# EAGLE design 5vAc Dc (EAGLE 9.6.2)
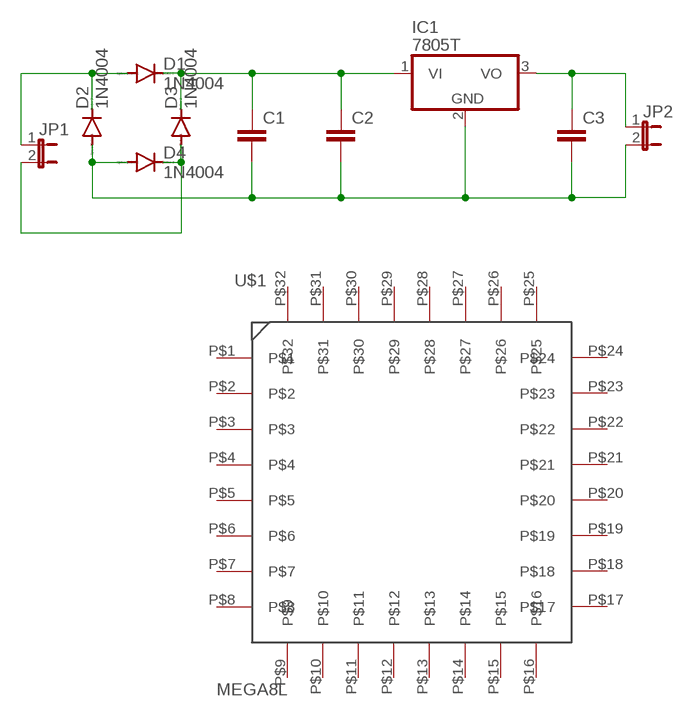
[diagram p0: schematic, sheet 1]

## Parts
C1  C2,5-3  [C2.5-3]
C2  C2,5-3  [C2.5-3]
C3  C2,5-3  [C2.5-3]
D1  1N4004  [DO41-10]
D2  1N4004  [DO41-10]
D3  1N4004  [DO41-10]
D4  1N4004  [DO41-10]
IC1  7805T  [TO220H]
JP1  JP1E  [JP1]
JP2  JP1E  [JP1]
U$1  MEGA8L  [TQFP_MEGA8L]

## Nets
N$1: D1.A D2.C JP1.1
N$2: C1.2 C2.2 C3.2 D2.A D4.A IC1.2(GND) JP2.2
N$3: D3.A D4.C JP1.2
N$4: C1.1 C2.1 D1.C D3.C IC1.1(VI)
N$5: C3.1 IC1.3(VO) JP2.1
Unconnected: U$1.P$1 U$1.P$2 U$1.P$3 U$1.P$4 U$1.P$5 U$1.P$6 U$1.P$7 U$1.P$8 U$1.P$9 U$1.P$10 U$1.P$11 U$1.P$12 U$1.P$13 U$1.P$14 U$1.P$15 U$1.P$16 U$1.P$17 U$1.P$18 U$1.P$19 U$1.P$20 U$1.P$21 U$1.P$22 U$1.P$23 U$1.P$24 U$1.P$25 U$1.P$26 U$1.P$27 U$1.P$28 U$1.P$29 U$1.P$30 U$1.P$31 U$1.P$32

## Library data of the parts
C1-C3 = capacitor-wima:C: CAPACITOR naming: grid - package width
D1-D4 = diode:1N4004: DIODE general purpose rectifier, 1 A
IC1 = linear:78*: Positive VOLTAGE REGULATOR Source: http://cache.national.com/ds/LM/LM78L05.pdf http://www.fairchildsemi.com/ds/LM/LM7805.pdf
JP1 JP2 = jumper:JP1E: JUMPER
U$1 = atmega8:MEGA8L

## Board
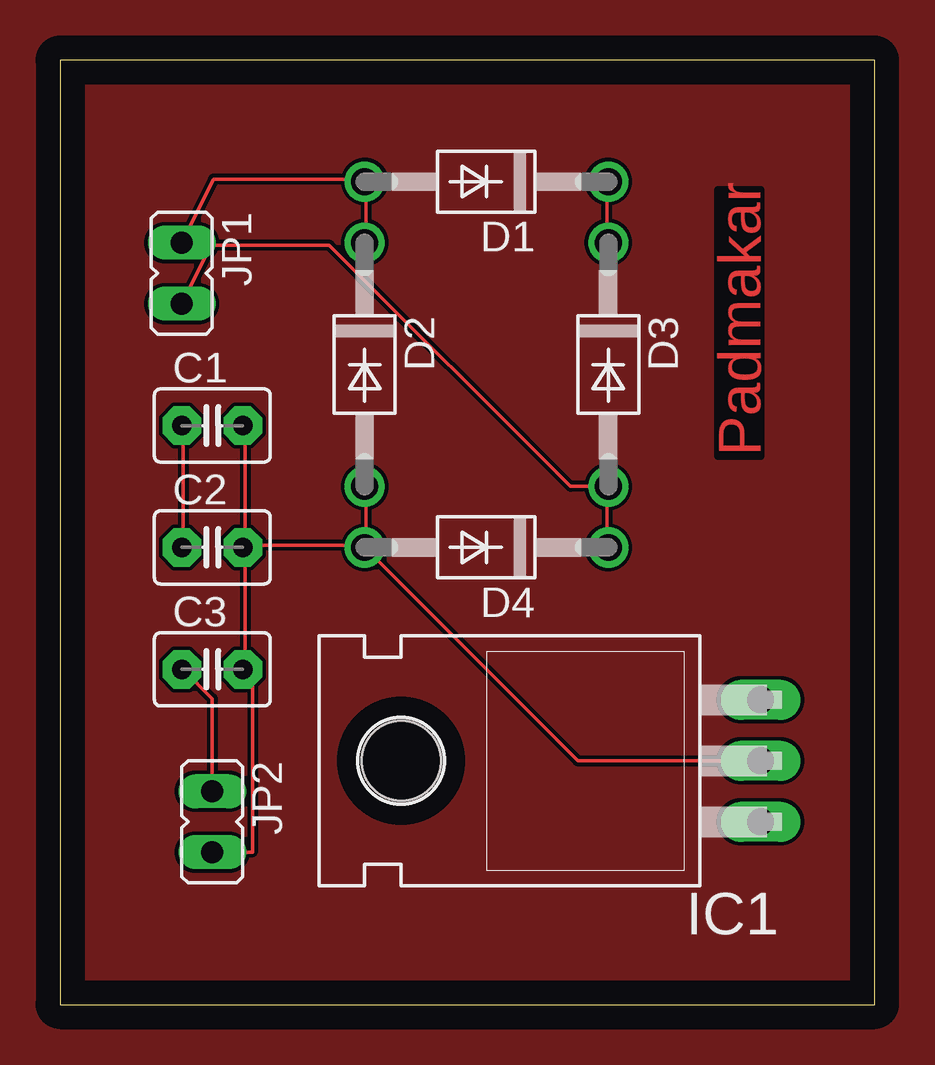
[diagram p1: board, top side]
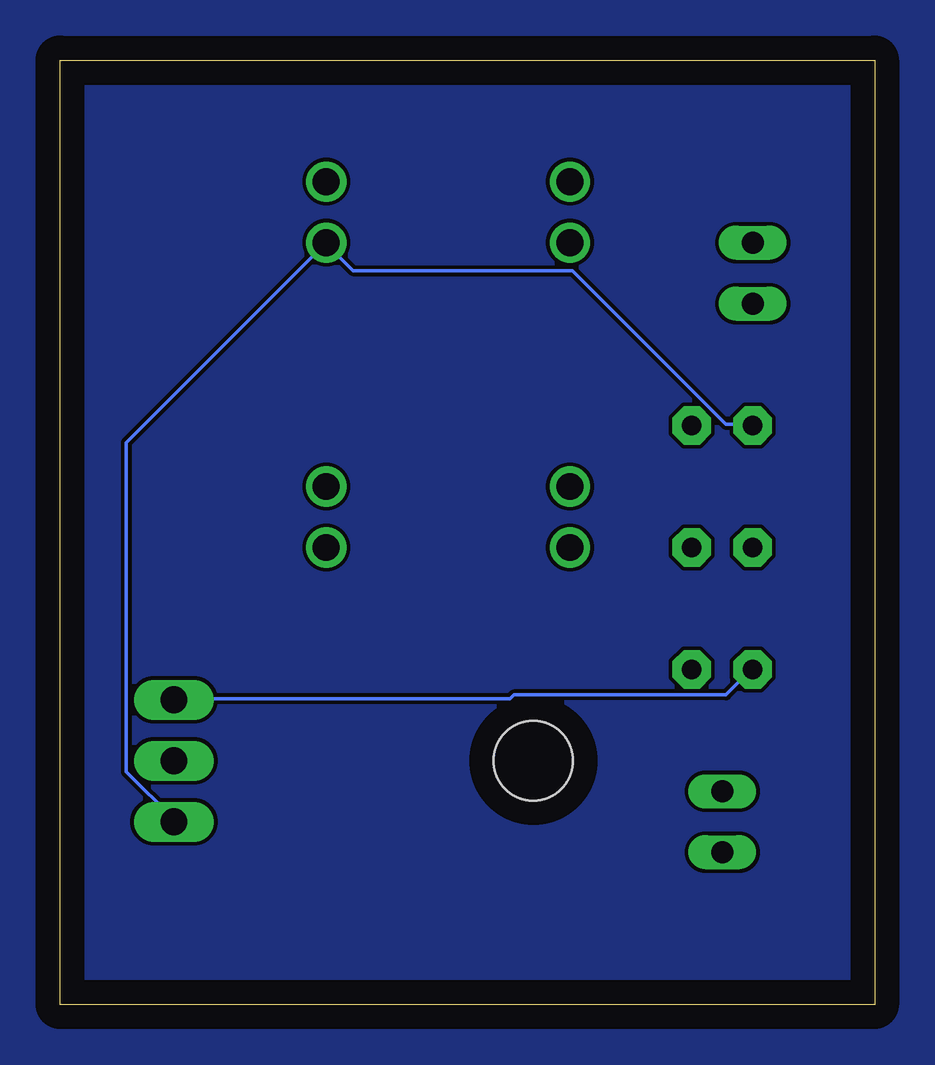
[diagram p2: board, bottom side, seen from below]

Size 33.96 x 39.36 mm. Coordinates in mm from the lower left corner, seen from the top.
Outline: 0,0 33.96,0 33.96,39.36 0,39.36 0,0
Copper layers (1*16): Top 0.035mm / dielectric 1.5mm / Bottom 0.035mm
Design rules "default": minimum track width 6mil, minimum drill 0.35mm, track to track 6mil, track to pad 6mil, pad to pad 6mil, via to via 6mil, smd to smd 6mil, copper to edge 40mil, drill to drill 6mil, minimum pad ring 10mil, minimum via ring 8mil, stop-mask expansion 4mil, vias tented up to drill 0mil, thermal gap 10mil

### Footprints (pad centres in the part's own frame; a part is rotated, then mirrored left to right if it is on the bottom)
C2.5-3 = drill 0.813 pad 1.6 octagon: 1 -1.27,0; 2 1.27,0
DO41-10 = drill 1.118: A 5.08,0; C -5.08,0
TO220H = drill 1.118 long: 1 -2.54,-10.16; 2 0,-10.16; 3 2.54,-10.16 | hole 3.302: 0,4.826
JP1 = drill 0.914 long: 1 0,-1.27; 2 0,1.27

### Placement (x,y rotation side)
C1  6.35,24.13 0 top
C2  6.35,19.05 0 top
C3  6.35,13.97 0 top
D1  17.78,34.29 180 top
D2  12.7,26.67 270 top
D3  22.86,26.67 270 top
D4  17.78,19.05 180 top
IC1  19.05,10.16 90 top
JP1  5.08,30.48 180 top
JP2  6.35,7.62 180 top

### Tracks (layer width: path | path; a pad name or v marks a point on that pad's centre or on a via)
GND
  pour Top: -3.81,40.64 -3.81,-2.54 36.83,-2.54 36.83,40.64 36.83,43.18 -3.81,43.18
  pour Bottom: -6.35,44.45 -6.35,-5.08 -5.08,-5.08 39.37,-5.08 39.37,-3.81 39.37,46.99 35.56,46.99 -6.35,46.99
N$1
  Top 0.152: JP1.1 6.4,34.39 12.6,34.39 D1.A 12.75,34.24 12.75,31.8 D2.C
N$2
  Top 0.152: JP2.2 8.03,6.35 8.03,13.66 7.72,13.97 | 7.72,19.15 7.72,24.03 C1.2 | D4.A 12.75,19.15 12.75,21.59 D2.A | IC1.2 21.59,10.16 D4.A | 7.72,19.15 12.6,19.15 D4.A | 7.72,19.15 C2.2 7.72,19 7.72,13.97 | 7.72,13.97 C3.2
N$3
  Top 0.152: 22.81,21.59 21.28,21.59 11.23,31.65 6.3,31.65 JP1.2 | 22.81,21.59 22.81,19.15 D4.C | 22.81,21.59 D3.A
N$4
  Top 0.152: C2.1 5.13,19.15 5.13,24.03 C1.1 | D1.C 22.81,34.24 22.81,31.8 D3.C
  Bottom 0.152: IC1.1 29.21,7.72 31.19,9.7 31.19,23.42 D3.C 22.81,31.65 21.74,30.58 12.6,30.58 6.2,24.18 5.13,24.18 C1.1
N$5
  Top 0.152: JP2.1 6.35,12.75 5.13,13.97 C3.1
  Bottom 0.152: IC1.3 29.21,12.75 15.19,12.75 15.04,12.9 6.2,12.9 5.13,13.97 C3.1

### Text on the board
Top: Padmakar